# Altium schematic sheet MainShunt.SchDoc
size A3; SheetNumber: 1; SheetTotal: 11
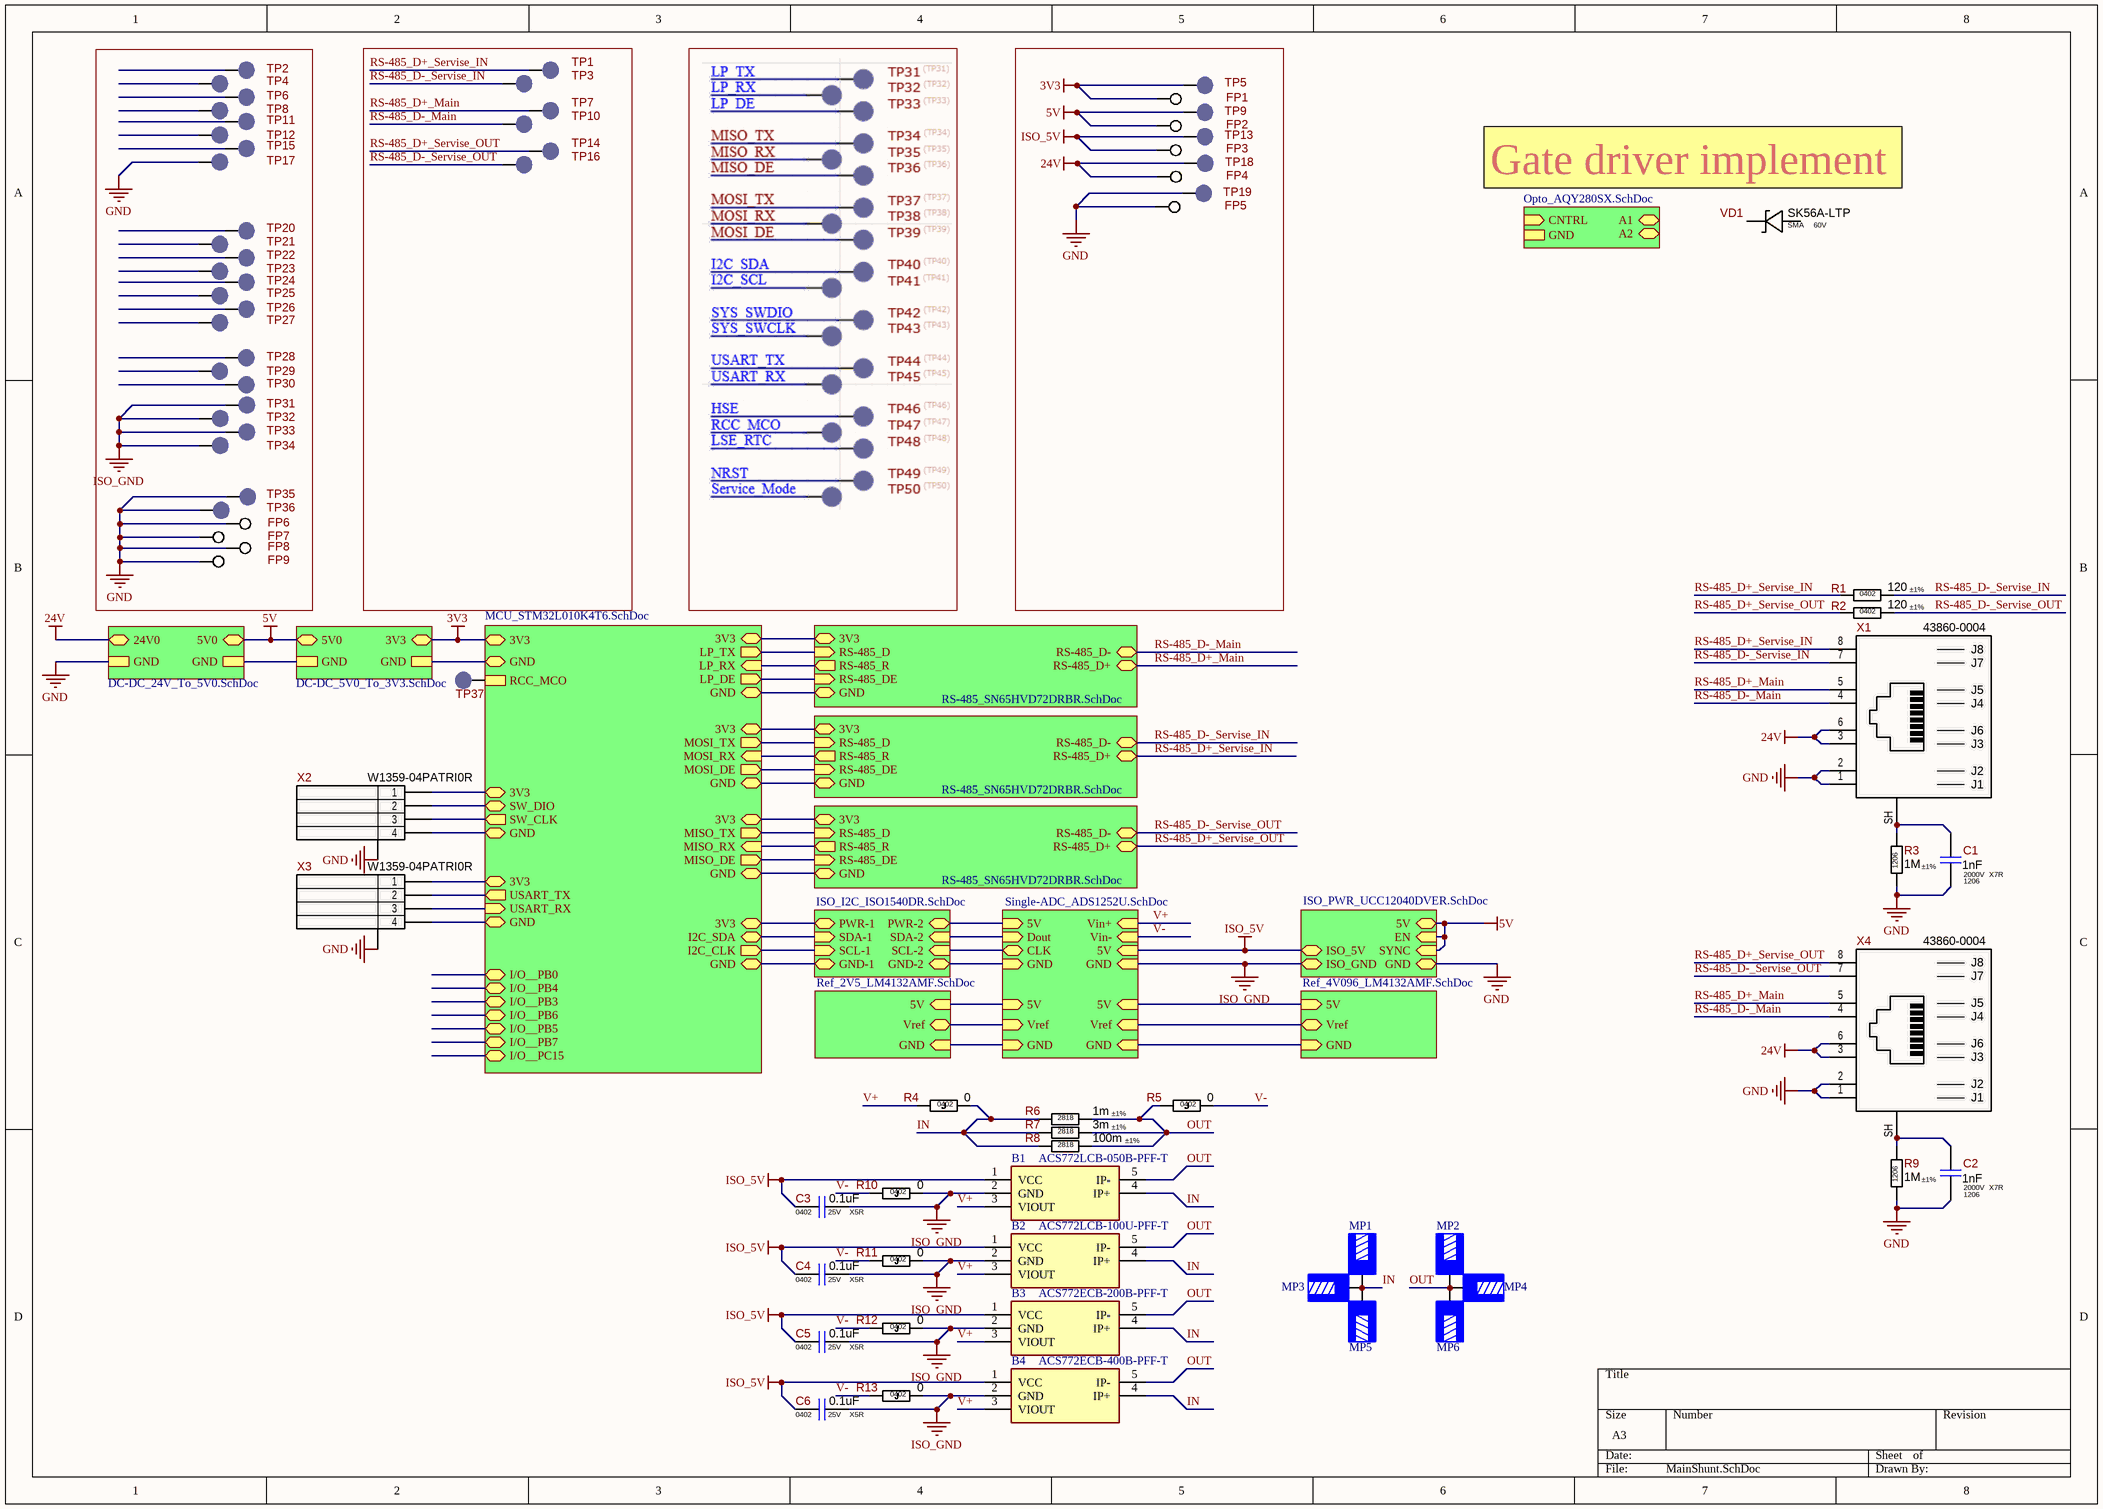
[diagram p0: MainShunt.SchDoc]

## Parts
B1  ACS772LCB-050B-PFF-T  [ACS772KCB_XXX_PFF_T]
B2  ACS772LCB-100U-PFF-T  [ACS772KCB_XXX_SMT_T]
B3  ACS772ECB-200B-PFF-T  [ACS772KCB_XXX_PFF_T]
B4  ACS772ECB-400B-PFF-T  [ACS772KCB_XXX_PFF_T]
C1  Package: 1206  Voltage: 2000V  Dielectric Type: X7R  [CAP-1206(3216)X125T20]  (hidden comment: 1nF)
C2  Package: 1206  Voltage: 2000V  Dielectric Type: X7R  [CAP-1206(3216)X125T20]  (hidden comment: 1nF)
C3  Package: 0402  Voltage: 25V  Dielectric Type: X5R  [C_CERAMIC_0402_MED]  (hidden comment: 0.1uF)
C4  Package: 0402  Voltage: 25V  Dielectric Type: X5R  [C_CERAMIC_0402_MED]  (hidden comment: 0.1uF)
C5  Package: 0402  Voltage: 25V  Dielectric Type: X5R  [C_CERAMIC_0402_MED]  (hidden comment: 0.1uF)
C6  Package: 0402  Voltage: 25V  Dielectric Type: X5R  [C_CERAMIC_0402_MED]  (hidden comment: 0.1uF)
FP1  PAD-1.1mm  [PAD-1.1mm]  (value not drawn)  (no BOM)
FP2  PAD-1.1mm  [PAD-1.1mm]  (value not drawn)  (no BOM)
FP3  PAD-1.1mm  [PAD-1.1mm]  (value not drawn)  (no BOM)
FP4  PAD-1.1mm  [PAD-1.1mm]  (value not drawn)  (no BOM)
FP5  PAD-1.1mm  [PAD-1.1mm]  (value not drawn)  (no BOM)
FP6  PAD-1.1mm  [PAD-1.1mm]  (value not drawn)  (no BOM)
FP7  PAD-1.1mm  [PAD-1.1mm]  (value not drawn)  (no BOM)
FP8  PAD-1.1mm  [PAD-1.1mm]  (value not drawn)  (no BOM)
FP9  PAD-1.1mm  [PAD-1.1mm]  (value not drawn)  (no BOM)
MP1  M6 x 9mm  [7461084_HAL]  (value not drawn)
MP2  M6 x 9mm  [7461084_HAL]  (value not drawn)
MP3  M6 x 9mm  [7461084_HAL]  (value not drawn)
MP4  M6 x 9mm  [7461084_HAL]  (value not drawn)
MP5  M6 x 9mm  [7461084_HAL]  (value not drawn)
MP6  M6 x 9mm  [7461084_HAL]  (value not drawn)
R1  Tolerance: ±1%  Package: 0402  [R_ANY_CHIP_0402_HI]  (hidden comment: 120)
R2  Tolerance: ±1%  Package: 0402  [R_ANY_CHIP_0402_HI]  (hidden comment: 120)
R3  Tolerance: ±1%  Package: 1206  [CHV1206-Series]  (hidden comment: 1M)
R4  Package: 0402  [R_ANY_CHIP_0402_HI]  (hidden comment: 0)
R5  Package: 0402  [R_ANY_CHIP_0402_HI]  (hidden comment: 0)
R6  Tolerance: ±1%  Package: 2818  [WSHP2818]  (hidden comment: 1m)
R7  Tolerance: ±1%  Package: 2818  [WSHP2818]  (hidden comment: 3m)
R8  Tolerance: ±1%  Package: 2818  [WSHP2818]  (hidden comment: 100m)
R9  Tolerance: ±1%  Package: 1206  [CHV1206-Series]  (hidden comment: 1M)
R10  Package: 0402  [R_ANY_CHIP_0402_HI]  (hidden comment: 0)
R11  Package: 0402  [R_ANY_CHIP_0402_HI]  (hidden comment: 0)
R12  Package: 0402  [R_ANY_CHIP_0402_HI]  (hidden comment: 0)
R13  Package: 0402  [R_ANY_CHIP_0402_HI]  (hidden comment: 0)
TP1  LED_LINK  [TP_SMD_2mm]  (value not drawn)  (no BOM)
TP2  LED_LINK  [TP_SMD_2mm]  (value not drawn)  (no BOM)
TP3  LED_LINK  [TP_SMD_2mm]  (value not drawn)  (no BOM)
TP4  LED_LINK  [TP_SMD_2mm]  (value not drawn)  (no BOM)
TP5  LED_LINK  [TP_SMD_2mm]  (value not drawn)  (no BOM)
TP6  LED_LINK  [TP_SMD_2mm]  (value not drawn)  (no BOM)
TP7  LED_LINK  [TP_SMD_2mm]  (value not drawn)  (no BOM)
TP8  LED_LINK  [TP_SMD_2mm]  (value not drawn)  (no BOM)
TP9  LED_LINK  [TP_SMD_2mm]  (value not drawn)  (no BOM)
TP10  LED_LINK  [TP_SMD_2mm]  (value not drawn)  (no BOM)
TP11  LED_LINK  [TP_SMD_2mm]  (value not drawn)  (no BOM)
TP12  LED_LINK  [TP_SMD_2mm]  (value not drawn)  (no BOM)
TP13  LED_LINK  [TP_SMD_2mm]  (value not drawn)  (no BOM)
TP14  LED_LINK  [TP_SMD_2mm]  (value not drawn)  (no BOM)
TP15  LED_LINK  [TP_SMD_2mm]  (value not drawn)  (no BOM)
TP16  LED_LINK  [TP_SMD_2mm]  (value not drawn)  (no BOM)
TP17  LED_LINK  [TP_SMD_2mm]  (value not drawn)  (no BOM)
TP18  LED_LINK  [TP_SMD_2mm]  (value not drawn)  (no BOM)
TP19  LED_LINK  [TP_SMD_2mm]  (value not drawn)  (no BOM)
TP20  LED_LINK  [TP_SMD_2mm]  (value not drawn)  (no BOM)
TP21  LED_LINK  [TP_SMD_2mm]  (value not drawn)  (no BOM)
TP22  LED_LINK  [TP_SMD_2mm]  (value not drawn)  (no BOM)
TP23  LED_LINK  [TP_SMD_2mm]  (value not drawn)  (no BOM)
TP24  LED_LINK  [TP_SMD_2mm]  (value not drawn)  (no BOM)
TP25  LED_LINK  [TP_SMD_2mm]  (value not drawn)  (no BOM)
TP26  LED_LINK  [TP_SMD_2mm]  (value not drawn)  (no BOM)
TP27  LED_LINK  [TP_SMD_2mm]  (value not drawn)  (no BOM)
TP28  LED_LINK  [TP_SMD_2mm]  (value not drawn)  (no BOM)
TP29  LED_LINK  [TP_SMD_2mm]  (value not drawn)  (no BOM)
TP30  LED_LINK  [TP_SMD_2mm]  (value not drawn)  (no BOM)
TP31  LED_LINK  [TP_SMD_2mm]  (value not drawn)  (no BOM)
TP32  LED_LINK  [TP_SMD_2mm]  (value not drawn)  (no BOM)
TP33  LED_LINK  [TP_SMD_2mm]  (value not drawn)  (no BOM)
TP34  LED_LINK  [TP_SMD_2mm]  (value not drawn)  (no BOM)
TP35  LED_LINK  [TP_SMD_2mm]  (value not drawn)  (no BOM)
TP36  LED_LINK  [TP_SMD_2mm]  (value not drawn)  (no BOM)
TP37  LED_LINK  [TP_SMD_2mm]  (value not drawn)  (no BOM)
VD1  Package: SMA  Voltage: 60V  [SMA_MED]  (hidden comment: SK56A-LTP)
X1  43860-0004  [43860-0004]
X2  W1359-04PATRI0R  [W1359-04PATXI0R_DBG]
X3  W1359-04PATRI0R  [W1359-04PATXI0R_DBG]
X4  43860-0004  [43860-0004]

## Sub-sheets
ADC = Single-ADC_ADS1252U.SchDoc: Vin+ (in), CLK (bidir), Vin- (in), 5V (in), GND (in), Dout (in), 5V (in), GND (in), 5V (in), 5V (in), Vref (in), Vref (in), GND (in), GND (in)
CellSelectModule = Opto_AQY280SX.SchDoc: CNTRL (in), A1 (bidir), A2 (bidir), GND
ISO_5V = ISO_PWR_UCC12040DVER.SchDoc: ISO_5V (bidir), 5V (bidir), GND (bidir), ISO_GND (bidir), EN (in), SYNC (in)
ISO_I2C = ISO_I2C_ISO1540DR.SchDoc: PWR-2 (bidir), PWR-1 (bidir), GND-1 (bidir), GND-2 (bidir), SDA-1 (in), SCL-1 (in), SDA-2 (in), SCL-2 (in)
ISO_I2C = Ref_2V5_LM4132AMF.SchDoc: Vref (bidir), 5V (in), GND (in)
ISO_I2C = Ref_4V096_LM4132AMF.SchDoc: Vref (bidir), 5V (in), GND (in)
LDO_3V3 = DC-DC_5V0_To_3V3.SchDoc: 3V3 (bidir), 5V0 (bidir), GND, GND
LDO_3V3 = DC-DC_24V_To_5V0.SchDoc: 5V0 (bidir), 24V0 (bidir), GND, GND
MCU = MCU_STM32L010K4T6.SchDoc: LP_TX (out), LP_RX (in), LP_DE (out), MISO_TX (out), MISO_RX (in), MISO_DE (out), MOSI_RX (in), MOSI_TX (out), MOSI_DE (out), I2C_SDA (bidir), I2C_CLK (out), SW_DIO (bidir), SW_CLK (out), USART_TX (out), USART_RX (in), RCC_MCO, I/O__PB0 (bidir), I/O__PB3 (bidir), I/O__PB4 (bidir), I/O__PB5 (bidir), I/O__PB6 (bidir), I/O__PB7 (bidir), I/O__PC15 (bidir), 3V3 (bidir), 3V3 (bidir), 3V3 (bidir), 3V3 (bidir), 3V3 (bidir), GND (bidir), GND (bidir), GND (bidir), GND (bidir), GND (bidir), GND (bidir), GND (bidir), 3V3 (bidir), 3V3 (bidir)
RS-485 = RS-485_SN65HVD72DRBR.SchDoc: 3V3 (bidir), RS-485_D+ (bidir), RS-485_D- (bidir), RS-485_R (out), RS-485_D (in), RS-485_DE (in), GND (bidir)
RS-485 = RS-485_SN65HVD72DRBR.SchDoc: 3V3 (bidir), RS-485_D+ (bidir), RS-485_D- (bidir), RS-485_R (out), RS-485_D (in), RS-485_DE (in), GND (bidir)
RS-485 = RS-485_SN65HVD72DRBR.SchDoc: 3V3 (bidir), RS-485_D+ (bidir), RS-485_D- (bidir), RS-485_R (out), RS-485_D (in), RS-485_DE (in), GND (bidir)

## Nets
3V3: FP1.1 TP5.1 ; sheet LDO_3V3/3V3, sheet MCU/3V3
5V: FP2.1 TP9.1 ; sheet LDO_3V3/5V0, sheet ISO_5V/5V, sheet ISO_5V/EN, sheet ISO_5V/SYNC, sheet LDO_3V3/5V0
24V: FP4.1 TP18.1 X1.3(TD3-) X1.6(CT) X4.3(TD3-) X4.6(CT) ; sheet LDO_3V3/24V0
GND: C1.2 C2.2 FP5.1 FP6.1 FP7.1 FP8.1 FP9.1 R3.2 R9.2 TP17.1 TP19.1 TP35.1 TP36.1 X1.1(TD4-) X1.2(TD4+) X2.MP(MountPad) X3.MP(MountPad) X4.1(TD4-) X4.2(TD4+) ; sheet ISO_5V/GND, sheet LDO_3V3/GND
ISO_5V: B1.1(VCC) B2.1(VCC) B3.1(VCC) B4.1(VCC) C3.1 C4.1 C5.1 C6.1 FP3.1 TP13.1 ; sheet ISO_5V/ISO_5V, sheet ADC/5V
ISO_GND: B1.2(GND) B2.2(GND) B3.2(GND) B4.2(GND) C3.2 C4.2 C5.2 C6.2 R10.1 R11.1 R12.1 R13.1 TP31.1 TP32.1 TP33.1 TP34.1 ; sheet ISO_5V/ISO_GND, sheet ADC/GND
IN: B1.4(IP+) B2.4(IP+) B3.4(IP+) B4.4(IP+) MP1.1 MP3.1 MP5.1 R4.1 R6.2 R7.2 R8.2
OUT: B1.5(IP-) B2.5(IP-) B3.5(IP-) B4.5(IP-) MP2.1 MP4.1 MP6.1 R5.2 R6.1 R7.1 R8.1
RS-485_D+_Main: TP7.1 X1.5(CT) X4.5(CT) ; sheet RS-485/RS-485_D+
RS-485_D+_Servise_IN: R1.1 TP1.1 X1.8(TD2+) ; sheet RS-485/RS-485_D+
RS-485_D+_Servise_OUT: R2.1 TP14.1 X4.8(TD2+) ; sheet RS-485/RS-485_D+
RS-485_D-_Main: TP10.1 X1.4(TD3+) X4.4(TD3+) ; sheet RS-485/RS-485_D-
RS-485_D-_Servise_IN: R1.2 TP3.1 X1.7(TD2-) ; sheet RS-485/RS-485_D-
RS-485_D-_Servise_OUT: R2.2 TP16.1 X4.7(TD2-) ; sheet RS-485/RS-485_D-
V+: B1.3(VIOUT) B2.3(VIOUT) B3.3(VIOUT) B4.3(VIOUT) R4.2 ; sheet ADC/Vin+
V-: R5.1 R10.2 R11.2 R12.2 R13.2 ; sheet ADC/Vin-
NetC1_1: C1.1 R3.1 X1.SH(Shield)
NetC2_1: C2.1 R9.1 X4.SH(Shield)
NetTP37_1: TP37.1 ; sheet MCU/RCC_MCO
NetX2_1: X2.1 ; sheet MCU/3V3
NetX2_2: X2.2 ; sheet MCU/SW_DIO
NetX2_3: X2.3 ; sheet MCU/SW_CLK
NetX2_4: X2.4 ; sheet MCU/GND
NetX3_1: X3.1 ; sheet MCU/3V3
NetX3_2: X3.2 ; sheet MCU/USART_TX
NetX3_3: X3.3 ; sheet MCU/USART_RX
NetX3_4: X3.4 ; sheet MCU/GND
(unnamed): sheet LDO_3V3/GND, sheet MCU/GND
(unnamed): sheet LDO_3V3/GND, sheet LDO_3V3/GND
(unnamed): sheet ISO_I2C/PWR-2, sheet ADC/5V
(unnamed): sheet ISO_I2C/PWR-1, sheet MCU/3V3
(unnamed): sheet ISO_I2C/GND-1, sheet MCU/GND
(unnamed): sheet ISO_I2C/GND-2, sheet ADC/GND
(unnamed): sheet ISO_I2C/SDA-1, sheet MCU/I2C_SDA
(unnamed): sheet ISO_I2C/SCL-1, sheet MCU/I2C_CLK
(unnamed): sheet ISO_I2C/SDA-2, sheet ADC/Dout
(unnamed): sheet ISO_I2C/SCL-2, sheet ADC/CLK
(unnamed): sheet ADC/5V, sheet ISO_I2C/5V
(unnamed): sheet ADC/5V, sheet ISO_I2C/5V
(unnamed): sheet ADC/Vref, sheet ISO_I2C/Vref
(unnamed): sheet ADC/Vref, sheet ISO_I2C/Vref
(unnamed): sheet ADC/GND, sheet ISO_I2C/GND
(unnamed): sheet ADC/GND, sheet ISO_I2C/GND
(unnamed): sheet MCU/LP_TX, sheet RS-485/RS-485_D
(unnamed): sheet MCU/LP_RX, sheet RS-485/RS-485_R
(unnamed): sheet MCU/LP_DE, sheet RS-485/RS-485_DE
(unnamed): sheet MCU/MISO_TX, sheet RS-485/RS-485_D
(unnamed): sheet MCU/MISO_RX, sheet RS-485/RS-485_R
(unnamed): sheet MCU/MISO_DE, sheet RS-485/RS-485_DE
(unnamed): sheet MCU/MOSI_RX, sheet RS-485/RS-485_R
(unnamed): sheet MCU/MOSI_TX, sheet RS-485/RS-485_D
(unnamed): sheet MCU/MOSI_DE, sheet RS-485/RS-485_DE
(unnamed): sheet MCU/3V3, sheet RS-485/3V3
(unnamed): sheet MCU/3V3, sheet RS-485/3V3
(unnamed): sheet MCU/GND, sheet RS-485/GND
(unnamed): sheet MCU/GND, sheet RS-485/GND
(unnamed): sheet MCU/GND, sheet RS-485/GND
(unnamed): sheet MCU/3V3, sheet RS-485/3V3

Not connected (* = marked no-connect by the designer): TP2 1; TP4 1; TP6 1; TP8 1; TP11 1; TP12 1; TP15 1; TP20 1; TP21 1; TP22 1; TP23 1; TP24 1; TP25 1; TP26 1; TP27 1; TP28 1; TP29 1; TP30 1; VD1 AN CA

## Notes on the sheet
- (near VD1) Gate driver implement
- (in symbol 43860-0004) J8; J7; J5; J4; J6; J3; J2; J1

## Library data of the parts
B1 = ACS772LCB-050B-PFF-T: 200kHz, 1.5% Max Tolerance, 100  Internal Resistance Module-alternative Current Sensor for High Current and High Voltage Applications; Current Rating: 50 A; Sensor Type: Current Sense; Accuracy: 1 %; Response Time: 2.5 us; Output Type: Analog; Supply Voltage: 4.5 V to 5.5 V; ComponentLink1Description: New link; ComponentLink1URL: https://eu.mouser.com/datasheet/2/1115/ACS772_Datasheet-3074305.pdf; Part Number: ACS772LCB-050B-PFF-T; Supplier 1: Mouser; Supplier Part Number 1: 250-772LCB050BPFFT; Parameter 6: *; Parameter 7: *; Frequency Range: 200 kHz; Type: Hall-Effect
B2 = ACS772LCB-100U-PFF-T: 200kHz, 1.5% Max Tolerance, 100  Internal Resistance Module-alternative Current Sensor for High Current and High Voltage Applications; Current Rating: 100 A; Sensor Type: Current Sense; Accuracy: 1 %; Response Time: 2.5 us; Output Type: Analog; Supply Voltage: 4.5 V to 5.5 V; ComponentLink1Description: New link; ComponentLink1URL: https://eu.mouser.com/datasheet/2/1115/ACS772_Datasheet-3074305.pdf; Part Number: ACS772LCB-100U-PFF-T; Supplier 1: Mouser; Supplier Part Number 1: 250-772LCB100UPFFT; Parameter 6: *; Parameter 7: *; Frequency Range: 200 kHz; Type: Hall-Effect
B3 = ACS772ECB-200B-PFF-T: 200kHz, 1.5% Max Tolerance, 100  Internal Resistance Module-alternative Current Sensor for High Current and High Voltage Applications; Current Rating: 200 A; Sensor Type: Current Sense; Accuracy: 1 %; Response Time: 2.5 us; Output Type: Analog; Supply Voltage: 4.5 V to 5.5 V; ComponentLink1Description: New link; ComponentLink1URL: https://eu.mouser.com/datasheet/2/1115/ACS772_Datasheet-3074305.pdf; Part Number: ACS772ECB-200B-PFF-T; Supplier 1: Mouser; Supplier Part Number 1: 250-772ECB200BPFFT; Parameter 6: *; Parameter 7: *; Frequency Range: 200 kHz; Type: Hall-Effect
B4 = ACS772ECB-400B-PFF-T: 200kHz, 1.5% Max Tolerance, 100  Internal Resistance Module-alternative Current Sensor for High Current and High Voltage Applications; Current Rating: 400 A; Sensor Type: Current Sense; Accuracy: 1 %; Response Time: 2.5 us; Output Type: Analog; Supply Voltage: 4.5 V to 5.5 V; ComponentLink1Description: New link; ComponentLink1URL: https://eu.mouser.com/datasheet/2/1115/ACS772_Datasheet-3074305.pdf; Part Number: ACS772ECB-400B-PFF-T; Supplier 1: Mouser; Supplier Part Number 1: 250-772ECB400BPFFT; Parameter 6: *; Parameter 7: *; Frequency Range: 200 kHz; Type: Hall-Effect
C1 C2 = Capacitor-NonPolar: 1nF 2000V X7R ±10% 1206 Ceramic Capacitor RoHS; Part Number: CC1206KKX7RDBB102; Manufacturer: Yageo; Replacement: NONE; Value: 1nF; Part Type: Ceramic / X7R / 1206; Component Type: SMD; Temperature Range: -55°C ~ 125°C; Tolerance: ±10%; ComponentLink1URL: https://www.yageo.com/upload/media/product/products/datasheet/mlcc/UPY-NP0X7R_HV_1KV-to-3KV_11.pdf; Supplier 1: Digi-Key; Supplier Part Number 1: 311-1487-2-ND; ComponentLink1Description: Datasheet
C3-C6 = CL05A104KA5NNNC: 100nF 25V X5R ±10% 0402 Ceramic Capacitor RoHS; Manufacturer: Samsung Electro-Mechanics; Standard Lead Time: 38 Weeks; Component Status: Released; Replacement: NONE; Part Number: CL05A104KA5NNNC; Part Type: Ceramic / X5R / 0402; Component Type: SMD; Temperature Range: -55°C ~ 85°C; Tolerance: ±10%; ComponentLink1URL: https://eu.mouser.com/datasheet/2/585/MLCC-1837944.pdf; ComponentLink1Description: Datasheet; Price: 0.0013; Supplier 1: Mouser; Supplier Part Number 1: 187-CL05A104KA5NNNC; Value: 0.1uF
FP1-FP9 = Pad: 1.1mm Pad for Plug-In or Receptacle; Manufacturer: NONE; Component Status: Released; Part Number: PAD-1.1mm; Component Type: PTH; Part Type: Pad; Temperature Range: NONE; ComponentLink1URL: NONE; Replacement: NONE; ComponentLink1Description: Datasheet; Price: NONE
MP1-MP6 = 7461084: WP-BUTR REDCUBE PRESS-FIT with internal thread, two-rows, L10W10H13.5mm, M6 x 9mm, 160A; Manufacturer: Wurth Elektronik; Surface: Tin; ComponentLink1Description: Website Link; ComponentLink1URL: https://www.we-online.com/redexpert/article/7461084?ad; ComponentLink2Description: Datasheet Link; ComponentLink2URL: https://www.we-online.com/redexpert/spec/7461084?ad; Manufacturer Part Number: 7461084; Category: REDCUBE PRESS-FIT; Match Code: WP-BUTR; Mount: Press Fit; Operating Temperature Max: 150°C; Operating Temperature Min: -55°C; Packaging: Bulk; Length: 10mm; Width: 10mm; Height: 13.5mm; Material: Brass; Number of Pins: 8; Rated Current: 160A; Thread Length: 9mm; Thread Size: M6; Supplier 1: Mouser; Supplier Part Number 1: 710-7461084
R1 R2 = Resistor: 120 Ohms ±1% 1/16W 0402 Thick Film Resistor; Part Number: RC0402FR-07120RL; Manufacturer: Yageo; Power Rating: 0.062W; Voltage: 50V; Component Status: Released; Temperature Stability: ±100ppm/°C; Replacement: NONE; Value: 120; Component Type: SMD; Part Type: Thick Film; Temperature Range: -55°C ~ 155°C; ComponentLink1URL: https://eu.mouser.com/datasheet/2/447/PYu_RC_Group_51_RoHS_L_10-1664068.pdf; Price: 0.00065; ComponentLink1Description: Datasheet
R3 R9 = Resistor: 1 MOhms ±1%, 1/4W 1206 Thick Film Resistor; Part Number: CHV1206-FX-1004ELF; Manufacturer: Bourns; Power Rating: 0.25W; Voltage: 800V; Component Status: Released; Temperature Stability: ±100ppm/°C; Replacement: NONE; Value: 1M; Component Type: SMD; Part Type: Thick Film; Temperature Range: -55°C ~ 155°C; ComponentLink1URL: https://eu.mouser.com/datasheet/2/54/CHV-777595.pdf; Supplier 1: Mouser; Supplier Part Number 1: 652-CHV1206FX1004ELF; Price: 0.0173216; ComponentLink1Description: Datasheet
R4 R5 R10-R13 = RC0402JR-070RL: 0 Ohms Jumper ±5% 1/16W 0402 Thick Film Resistor; Manufacturer: Yageo; Power Rating: 0.062W; Voltage: 50V; Component Status: Released; Temperature Stability: NONE; Tolerance: ±5%; Part Number: RC0402JR-070RL; Component Type: SMD; Part Type: Thick Film; Temperature Range: -55°C ~ 155°C; ComponentLink1URL: https://eu.mouser.com/datasheet/2/447/PYu_RC_Group_51_RoHS_L_10-1664068.pdf; Supplier 1: Digi-Key; Supplier Part Number 1: 311-0.0JRTR-ND; Replacement: NONE; Price: 0.00045; ComponentLink1Description: Datasheet; Value: 0
R6 = WSHP28181L000FEA: Current Sense Resistors - SMD 10W .001ohms 1%; Manufacturer: Vishay; Temperature Stability: ±100ppm/°C; Replacement: NONE; Component Status: Released; Part Number: WSHP28181L000FEA; Component Type: SMD; Power Rating: 10W; Temperature Range: -55°C ~ 155°C; ComponentLink1URL: https://www.vishay.com/doc?30347; Supplier 1: Mouser; Supplier Part Number 1: 71-WSHP28181L000FEA; ComponentLink1Description: Datasheet; Part Type: Thick Film; Value: 1m
R7 = WSHP28183L000FEA: Current Sense Resistors - SMD 10W .003ohms 1%; Manufacturer: Vishay; Temperature Stability: ±100ppm/°C; Replacement: NONE; Component Status: Released; Part Number: WSHP28183L000FEA; Component Type: SMD; Power Rating: 10W; Temperature Range: -55°C ~ 155°C; ComponentLink1URL: https://www.vishay.com/doc?30347; Supplier 1: Mouser; Supplier Part Number 1: 71-WSHP28183L000FEA; ComponentLink1Description: Datasheet; Part Type: Thick Film; Value: 3m
R8 = WSHP2818R1000FEA: Current Sense Resistors - SMD 10W .100ohms 1%; Manufacturer: Vishay; Temperature Stability: ±100ppm/°C; Replacement: NONE; Component Status: Released; Part Number: WSHP2818R1000FEA; Component Type: SMD; Power Rating: 10W; Temperature Range: -55°C ~ 155°C; ComponentLink1URL: https://www.vishay.com/doc?30347; Supplier 1: Mouser; Supplier Part Number 1: 71-WSHP2818R1000FEA; ComponentLink1Description: Datasheet; Part Type: Thick Film; Value: 100m
TP1-TP37 = Test-Point-SMD-1: Test Point SMD Pad 1.0mm/1.5mm/2mm; Part Number: TP-PAD-SMD; Replacement: NONE; Part Type: Test Point; Component Type: SMD; Temperature Range: NONE; ComponentLink1URL: NONE; ComponentLink1Description: Datasheet
VD1 = SK56A-LTP: Diode Schottky 60V 5A, SMA; Manufacturer: Micro Commercial Components; Marking: SK56A; Standard Lead Time: 12 Weeks; Vf: 750mV @ 5A; Replacement: NONE; Component Status: Released; Part Type: Schottky; Component Type: SMD; Current: 5A; Temperature Range: -55°C ~ 150°C; ComponentLink1URL: \\altiumdb.ajax.local\files\Datasheet\Diodes\SK52A-L-SK510A-L(DO-214AC).pdf; Supplier 1: Digi-Key; Supplier Part Number 1: SK56A-LTPMSTR-ND; ComponentLink1Description: Datasheet; Price: 0.06; Part Number: SK56A-LTP
X1 X4 = 43860-0004: RJ45 8P8C Shielded Cat 3 10 Base-T Connector; Manufacturer: Molex; Component Status: Released; Replacement: NONE; Part Number: 43860-0004; Part Type: RJ-45; Component Type: PTH; Temperature Range: -40°C ~ 85°C; ComponentLink1URL: https://www.molex.com/pdm_docs/sd/438600004_sd.pdf; Supplier 1: Mouser; Supplier Part Number 1: 538-43860-0004; Price: 2.1435; ComponentLink1Description: Datasheet
X2 X3 = General-4-Pin-MP: 1.25mm Wire-to-Board Header, Vertical, SMT, 4 pin; Manufacturer: Hsuan Mao Technology; Component Status: Released; Replacement: 53398-0471; Part Number: W1359-04PATRI0R; Part Type: Wire-to-Board / 1.25mm; Component Type: SMD; Temperature Range: -40°C ~ 85°C; Price: 0.06